# EasyEDA Pro project ax08_doc.eprj, schematic ax08 main, sheets 14 to 16 of 16

## Sheets
14 carry unit: Page Name: carry unit
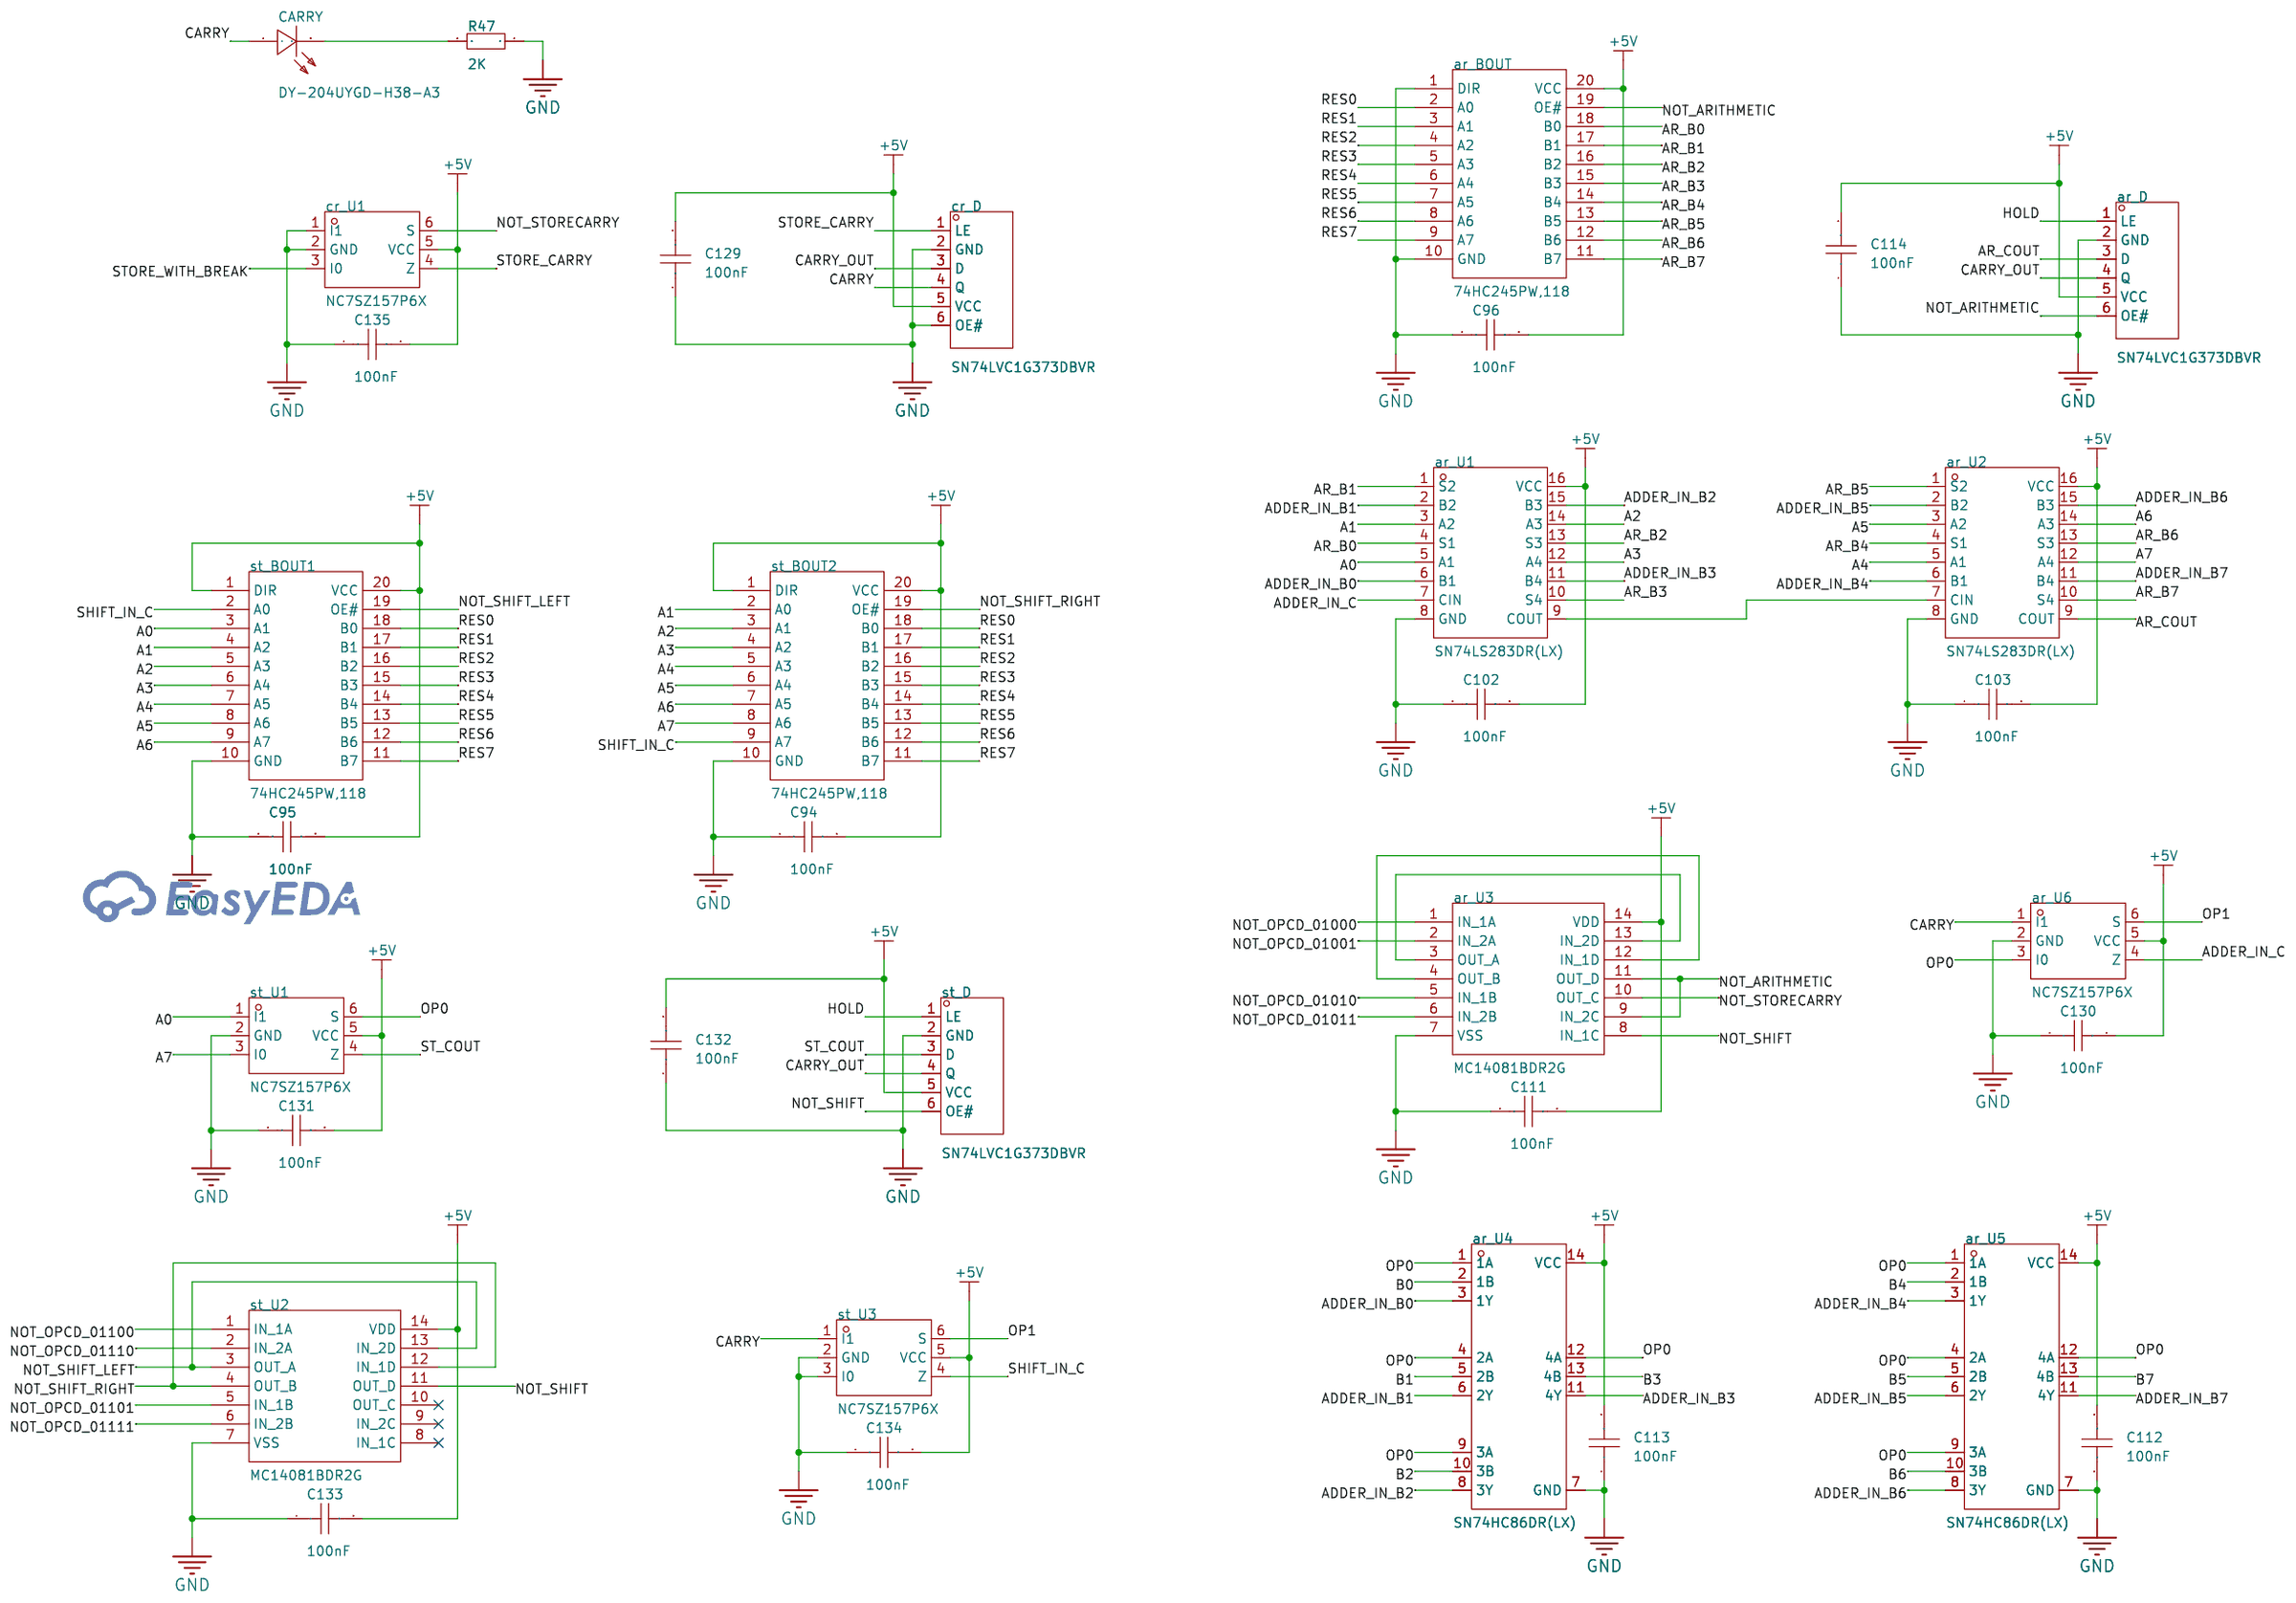
[diagram p18: carry unit]
15 power: Page Name: power; Update Date: 2025-09-11
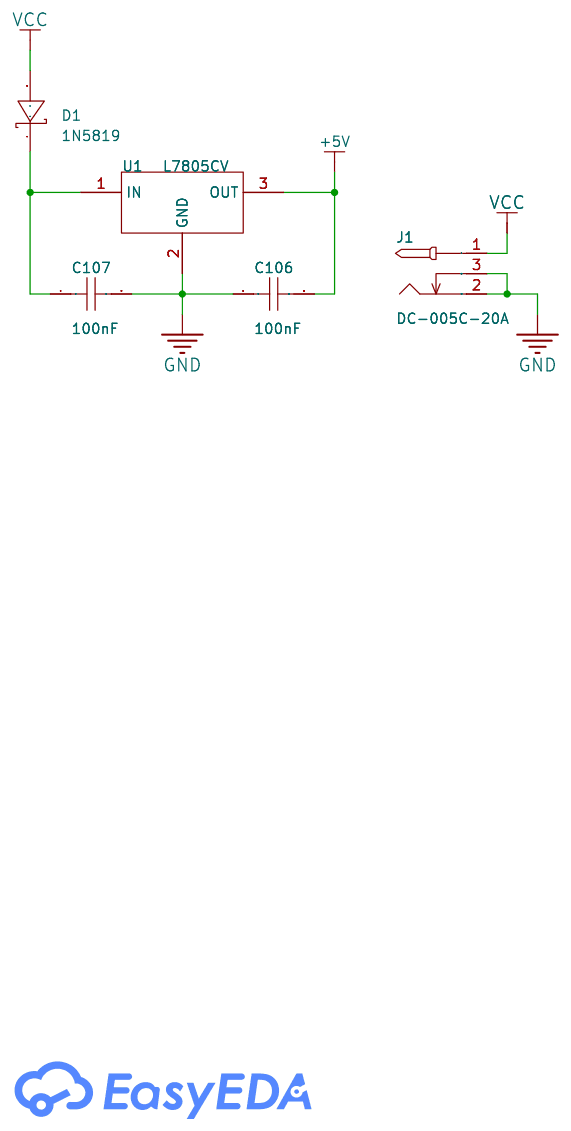
[diagram p19: power]
16 debug utils: Page Name: debug utils
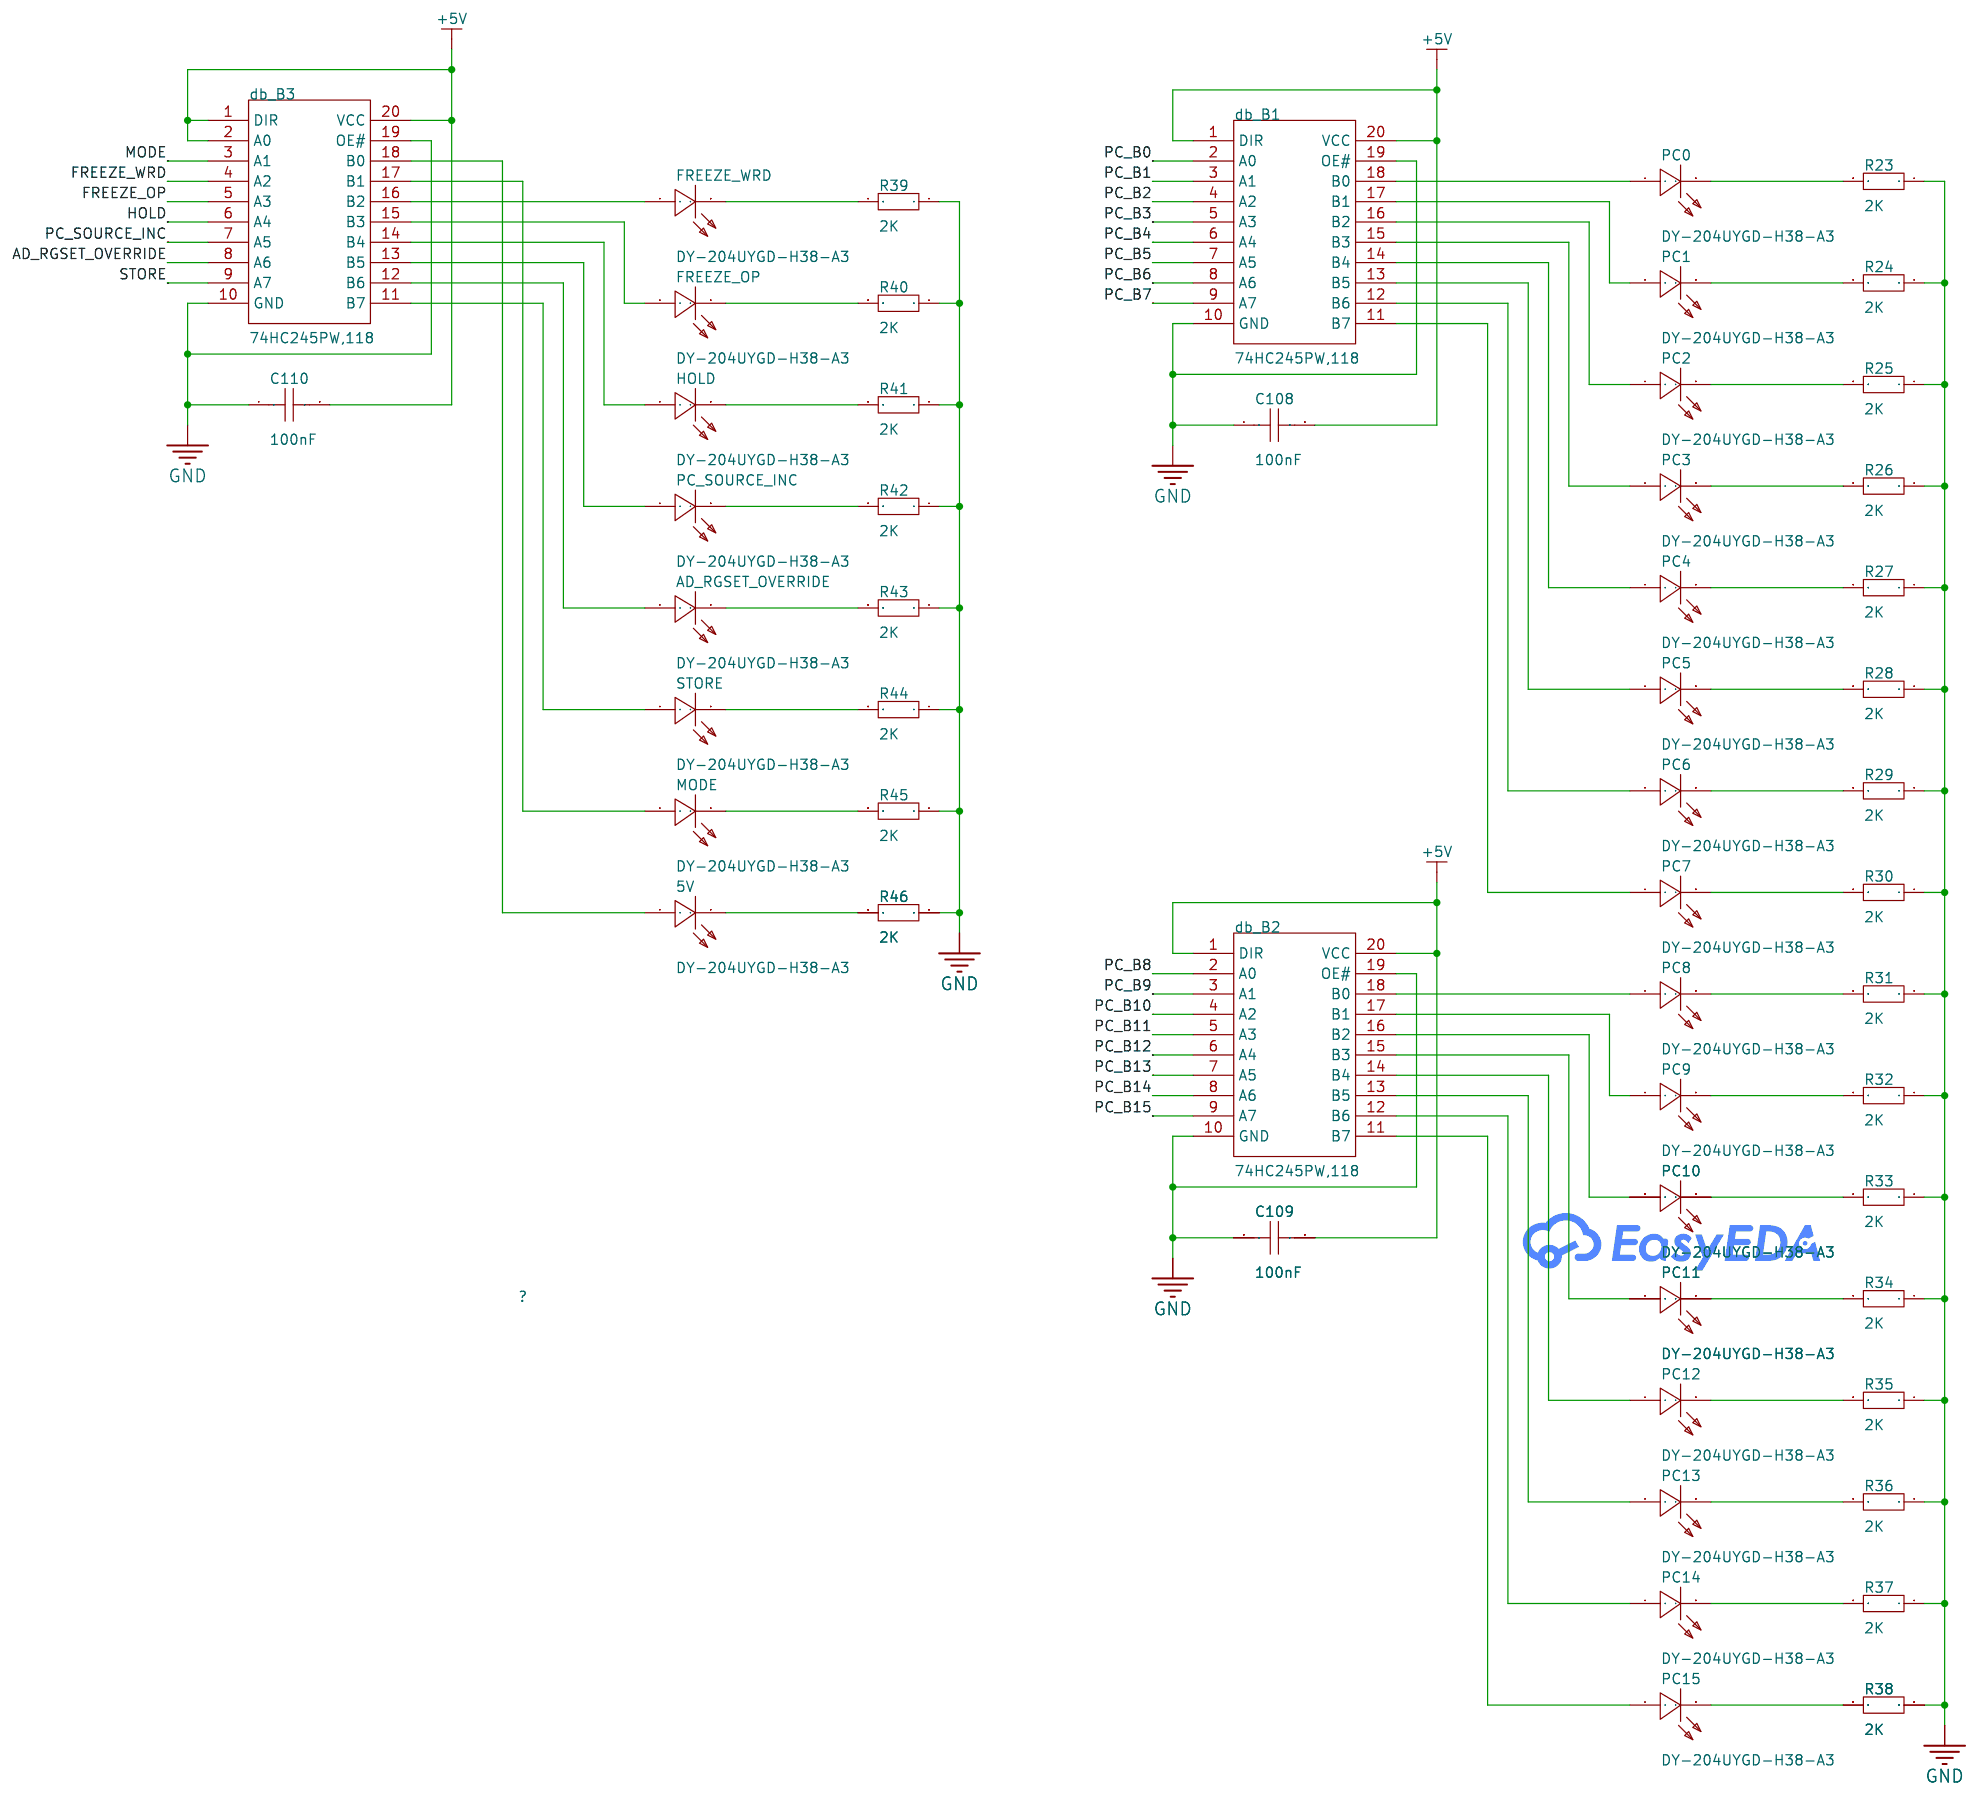
[diagram p20: debug utils]

## Parts
sheet carry unit
ar_BOUT  74HC245PW,118  [TSSOP-20_L6.5-W4.4-P0.65-LS6.4-BL]
ar_D  SN74LVC1G373DBVR  [SOT-23-6_L2.9-W1.6-P0.95-LS2.8-BR]
ar_U1  SN74LS283DR(LX)  [SOIC-16_L9.9-W3.9-P1.27-LS6.0-BL-1]
ar_U2  SN74LS283DR(LX)  [SOIC-16_L9.9-W3.9-P1.27-LS6.0-BL-1]
ar_U3  MC14081BDR2G  [SOIC-14_L8.7-W3.9-P1.27-LS6.0-BL]
ar_U4  SN74HC86DR(LX)  [SOP-14_L8.5-W3.8-P1.27-LS6.2-BL]
ar_U5  SN74HC86DR(LX)  [SOP-14_L8.5-W3.8-P1.27-LS6.2-BL]
ar_U6  NC7SZ157P6X  [SC-70-6_L2.0-W1.3-P0.65-LS2.1-BR]
C94  100nF  [C0805]
C95  100nF  [C0805]
C96  100nF  [C0805]
C102  100nF  [C0805]
C103  100nF  [C0805]
C111  100nF  [C0805]
C112  100nF  [C0805]
C113  100nF  [C0805]
C114  100nF  [C0805]
C129  100nF  [C0805]
C130  100nF  [C0805]
C131  100nF  [C0805]
C132  100nF  [C0805]
C133  100nF  [C0805]
C134  100nF  [C0805]
C135  100nF  [C0805]
CARRY  DY-204UYGD-H38-A3  [LED-TH_BD4.0-P2.54-FD]
cr_D  SN74LVC1G373DBVR  [SOT-23-6_L2.9-W1.6-P0.95-LS2.8-BR]
cr_U1  NC7SZ157P6X  [SC-70-6_L2.0-W1.3-P0.65-LS2.1-BR]
R47  2K  [R0805_1]
st_BOUT1  74HC245PW,118  [TSSOP-20_L6.5-W4.4-P0.65-LS6.4-BL]
st_BOUT2  74HC245PW,118  [TSSOP-20_L6.5-W4.4-P0.65-LS6.4-BL]
st_D  SN74LVC1G373DBVR  [SOT-23-6_L2.9-W1.6-P0.95-LS2.8-BR]
st_U1  NC7SZ157P6X  [SC-70-6_L2.0-W1.3-P0.65-LS2.1-BR]
st_U2  MC14081BDR2G  [SOIC-14_L8.7-W3.9-P1.27-LS6.0-BL]
st_U3  NC7SZ157P6X  [SC-70-6_L2.0-W1.3-P0.65-LS2.1-BR]
sheet debug utils
5V  DY-204UYGD-H38-A3  [LED-TH_BD4.0-P2.54-FD]
AD_RGSET_OVERRIDE  DY-204UYGD-H38-A3  [LED-TH_BD4.0-P2.54-FD]
C108  100nF  [C0805]
C109  100nF  [C0805]
C110  100nF  [C0805]
db_B1  74HC245PW,118  [TSSOP-20_L6.5-W4.4-P0.65-LS6.4-BL]
db_B2  74HC245PW,118  [TSSOP-20_L6.5-W4.4-P0.65-LS6.4-BL]
db_B3  74HC245PW,118  [TSSOP-20_L6.5-W4.4-P0.65-LS6.4-BL]
FREEZE_OP  DY-204UYGD-H38-A3  [LED-TH_BD4.0-P2.54-FD]
FREEZE_WRD  DY-204UYGD-H38-A3  [LED-TH_BD4.0-P2.54-FD]
HOLD  DY-204UYGD-H38-A3  [LED-TH_BD4.0-P2.54-FD]
MODE  DY-204UYGD-H38-A3  [LED-TH_BD4.0-P2.54-FD]
PC0  DY-204UYGD-H38-A3  [LED-TH_BD4.0-P2.54-FD]
PC1  DY-204UYGD-H38-A3  [LED-TH_BD4.0-P2.54-FD]
PC2  DY-204UYGD-H38-A3  [LED-TH_BD4.0-P2.54-FD]
PC3  DY-204UYGD-H38-A3  [LED-TH_BD4.0-P2.54-FD]
PC4  DY-204UYGD-H38-A3  [LED-TH_BD4.0-P2.54-FD]
PC5  DY-204UYGD-H38-A3  [LED-TH_BD4.0-P2.54-FD]
PC6  DY-204UYGD-H38-A3  [LED-TH_BD4.0-P2.54-FD]
PC7  DY-204UYGD-H38-A3  [LED-TH_BD4.0-P2.54-FD]
PC8  DY-204UYGD-H38-A3  [LED-TH_BD4.0-P2.54-FD]
PC9  DY-204UYGD-H38-A3  [LED-TH_BD4.0-P2.54-FD]
PC10  DY-204UYGD-H38-A3  [LED-TH_BD4.0-P2.54-FD]
PC11  DY-204UYGD-H38-A3  [LED-TH_BD4.0-P2.54-FD]
PC12  DY-204UYGD-H38-A3  [LED-TH_BD4.0-P2.54-FD]
PC13  DY-204UYGD-H38-A3  [LED-TH_BD4.0-P2.54-FD]
PC14  DY-204UYGD-H38-A3  [LED-TH_BD4.0-P2.54-FD]
PC15  DY-204UYGD-H38-A3  [LED-TH_BD4.0-P2.54-FD]
PC_SOURCE_INC  DY-204UYGD-H38-A3  [LED-TH_BD4.0-P2.54-FD]
R23  2K  [R0805_1]
R24  2K  [R0805_1]
R25  2K  [R0805_1]
R26  2K  [R0805_1]
R27  2K  [R0805_1]
R28  2K  [R0805_1]
R29  2K  [R0805_1]
R30  2K  [R0805_1]
R31  2K  [R0805_1]
R32  2K  [R0805_1]
R33  2K  [R0805_1]
R34  2K  [R0805_1]
R35  2K  [R0805_1]
R36  2K  [R0805_1]
R37  2K  [R0805_1]
R38  2K  [R0805_1]
R39  2K  [R0805_1]
R40  2K  [R0805_1]
R41  2K  [R0805_1]
R42  2K  [R0805_1]
R43  2K  [R0805_1]
R44  2K  [R0805_1]
R45  2K  [R0805_1]
R46  2K  [R0805_1]
STORE  DY-204UYGD-H38-A3  [LED-TH_BD4.0-P2.54-FD]
sheet power
C106  100nF  [C0805]
C107  100nF  [C0805]
D1  1N5819  [DO-41_BD2.4-L4.7-P8.70-D0.9-RD]
J1  DC-005C-20A  [DC-IN-TH_DC-005C-20A]
U1  L7805CV  [TO-220-3_L10.0-W4.5-P2.54-L]

## Library data of the parts
ar_BOUT db_B1-db_B3 st_BOUT1 st_BOUT2 = 74HC245PW,118: Input type:- output type:Tri-State Supply Voltage:2V~6V Supply Voltage:2V~6V Number of Elements:1 Number of Bits per Element:8 Channel Type:- Sink Current:7.8mA Source Current:7.8mA Logic Family:74HC Operating Temperature:-40℃~+125℃ Operating Temperature:; Supplier Part: C5626; Manufacturer: Nexperia(安世); Supplier Footprint: TSSOP-20; JLCPCB Part Class: Extended Part; Datasheet: https://atta.szlcsc.com/upload/public/pdf/source/20240724/EDC8C45902BA97AEC59E8811E3964917.pdf; Supplier: LCSC; output type: Tri-State; Supply Voltage: 2V~6V; Number of Elements: 1; Number of Bits per Element: 8; Sink Current: 7.8mA; Source Current: 7.8mA; Logic Family: 74HC; Operating Temperature: -40℃~+125℃
ar_D cr_D st_D = SN74LVC1G373DBVR: LCSC Part Name: 三态输出D型锁存器; Supplier Part: C128413; Manufacturer: TI(德州仪器); Supplier Footprint: SOT-23-6; JLCPCB Part Class: Extended Part; Datasheet: https://www.ti.com/cn/lit/gpn/sn74lvc1g373; Supplier: LCSC; Logic Type: D-Type Locking Device; Output Type: Tri-State; Supply Voltage: 1.65V~5.5V; Source Current: 32mA; Sink Current: 32mA; Propagation Delay: 1ns; OperatingTemperature: -40℃~+125℃
ar_U1 ar_U2 = SN74LS283DR(LX): Supplier Part: C22374103; Manufacturer: LX(灵星芯微); Supplier Footprint: SOP-16; JLCPCB Part Class: Extended Part; Datasheet: https://atta.szlcsc.com/upload/public/pdf/source/20240402/80BBEEF0EDCF1C8215BAA06339FE4235.pdf; Supplier: LCSC; Logic Type: Binary Full Adder; Number of Channels: 4; Supply Voltage: 2V~6V; Operating Temperature: -40℃~+125℃
ar_U3 st_U2 = MC14081BDR2G: Supplier Part: C52342; Manufacturer: onsemi(安森美); Supplier Footprint: SOIC-14; JLCPCB Part Class: Extended Part; Datasheet: https://atta.szlcsc.com/upload/public/pdf/source/20191203/C463300_6D19168778DBD465A86B239F140F6B23.pdf; Supplier: LCSC; Logic Gate Type: With Door; Number of Channels: 4; Supply Voltage: 3V~18V; Quiescent Current (Max): 1uA; Sink Current: 8.8mA; Source Current: 8.8mA; High Level Range (VIH): 3.5V~11V; Low Level Range (VIL): 1.5V~4V; Series: 4000BSeries; Propagation Delay Time: 100ns@15V,50pF; Operating Temperature: -55℃~+125℃
ar_U4 ar_U5 = SN74HC86DR(LX): LCSC Part Name: 集成电路; Supplier Part: C22436997; Manufacturer: LX(灵星芯微); Supplier Footprint: SOP-14; JLCPCB Part Class: Extended Part; Datasheet: https://atta.szlcsc.com/upload/public/pdf/source/20240524/675B1C928075FFB7AC00BEC82378813F.pdf; Supplier: LCSC; Logic Gate Type: XORGate; Number of Channels: 4; Supply Voltage: 2V~6V; Quiescent Current (Max): 2uA; High Level Range (VIH): 1.5V~4.2V; Low Level Range (VIL): 500mV~1.8V; Series: 74HCSeries; Propagation Delay Time: 20ns@6V,50pF; Operating Temperature: -40℃~+125℃
ar_U6 cr_U1 st_U1 st_U3 = NC7SZ157P6X: Supplier Part: C77686; Manufacturer: onsemi(安森美); Supplier Footprint: SC-70-6; JLCPCB Part Class: Extended Part; Datasheet: https://item.szlcsc.com/datasheet/NC7SZ157P6X/78815.html; Supplier: LCSC; Type: Multiplexer; Voltage Supply Source: Single Supply; Voltage - Supply: 1.65V~5.5V; Current - Output Low(IOL): 32mA; Current - Output High(IOH): 32mA; Operating temperature: -40℃~+85℃
C94-C96 C102 C103 C106-C114 C129-C135 = CC0805KRX7R9BB104: Capacitance: Tolerance:±10% Tolerance:±10% Voltage Rated: Temperature Coefficient:; LCSC Part Name: 100nF ±10% 50V; Supplier Part: C49678; Manufacturer: YAGEO(国巨); Supplier Footprint: 0805; JLCPCB Part Class: Basic Part; Datasheet: https://atta.szlcsc.com/upload/public/pdf/source/20180224/C181747_15194369449651363981.pdf; Supplier: LCSC; Tolerance: ±10%
5V AD_RGSET_OVERRIDE CARRY FREEZE_OP FREEZE_WRD HOLD MODE PC0-PC15 PC_SOURCE_INC STORE = DY-204UYGD-H38-A3: LCSC Part Name: 3mm圆头有边黄绿色; Supplier Part: C7470727; Manufacturer: TONYU(东裕); Supplier Footprint: D=3mm; JLCPCB Part Class: Extended Part; Datasheet: https://atta.szlcsc.com/upload/public/pdf/source/20230726/000EB079CD0A8C169FA94F7B667CD1E2.pdf; Supplier: LCSC
R23-R47 = Res_0603: Supplier Footprint: 0603
D1 = 1N5819_C237257: LCSC Part Name: 电压:40V 电流:1A; Supplier Part: C237257; Manufacturer: HL(豪林); Supplier Footprint: DO-41; JLCPCB Part Class: Extended Part; Supplier: LCSC; Forward Voltage (Vf@If): 600mV@1A; Reverse Voltage (Vr): 40V; Average Rectified Current (Io): 1A
J1 = DC-005C-20A: LCSC Part Name: DC电源插座 内径:2mm 外径:6.4mm; Supplier Part: C84007; Manufacturer: 韩国韩荣; Supplier Footprint: 插件; JLCPCB Part Class: Extended Part; Datasheet: https://atta.szlcsc.com/upload/public/pdf/source/20210810/A9F07BBB960FE584CB8DE17AFB8953D7.pdf; Supplier: LCSC; Connector Type: DC Power Receptacle; Mounting Style: Bend insert; Inside Contact Diameter: 2mm; Outside Contact Diameter: 6.4mm; Current Rating (Max): 3A; Voltage Rating (Max): 24V; Operating Temperature Range: -20℃~+70℃
U1 = L7805CV_C111887: LCSC Part Name: 正稳压器IC; Supplier Part: C111887; Manufacturer: ST(意法半导体); Supplier Footprint: TO-220; JLCPCB Part Class: Extended Part; Datasheet: https://atta.szlcsc.com/upload/public/pdf/source/20180606/C192854_20B6D8F8F52B6FFCE5644906251095FD.pdf; Supplier: LCSC; Output Type: Fixed; Maximum Input Voltage: 35V; Output Voltage: 5V; Output Current: 1.5A; Power Supply Rejection Ratio (PSRR): 62dB@(120Hz); Dropout Voltage: 2V@(1A); standby current: 8mA; Feature: Short-Circuit  Protection；Thermal Protection(TSD)；Overcurrent Protection(OCP); Operating Temperature: 0℃~+125℃; Output Polarity: Positive electrode; Number of Outputs: 1

## Nets
+5V: ar_BOUT.20(VCC) ar_D.5(VCC) ar_U1.16(VCC) ar_U2.16(VCC) ar_U3.14(VDD) ar_U4.14(VCC) ar_U5.14(VCC) ar_U6.5(VCC) C94.2 C95.2 C96.2 C102.2 C103.2 C106.2 C108.2 C109.2 C110.2 C111.2 C112.2 C113.2 C114.2 C129.2 C130.2 C131.2 C132.2 C133.2 C134.2 C135.2 cr_D.5(VCC) cr_U1.5(VCC) db_B1.1(DIR) db_B1.20(VCC) db_B2.1(DIR) db_B2.20(VCC) db_B3.1(DIR) db_B3.2(A0) db_B3.20(VCC) st_BOUT1.1(DIR) st_BOUT1.20(VCC) st_BOUT2.1(DIR) st_BOUT2.20(VCC) st_D.5(VCC) st_U1.5(VCC) st_U2.14(VDD) st_U3.5(VCC) U1.3(OUT) ; also on sheet 1 2 3 4 5 6 7 8 9 10 11 12 13
GND: ar_BOUT.1(DIR) ar_BOUT.10(GND) ar_D.2(GND) ar_U1.8(GND) ar_U2.8(GND) ar_U3.7(VSS) ar_U4.7(GND) ar_U5.7(GND) ar_U6.2(GND) C94.1 C95.1 C96.1 C102.1 C103.1 C106.1 C107.2 C108.1 C109.1 C110.1 C111.1 C112.1 C113.1 C114.1 C129.1 C130.1 C131.1 C132.1 C133.1 C134.1 C135.1 cr_D.2(GND) cr_D.6(OE#) cr_U1.1(I1) cr_U1.2(GND) db_B1.10(GND) db_B1.19(OE#) db_B2.10(GND) db_B2.19(OE#) db_B3.10(GND) db_B3.19(OE#) J1.2 J1.3 R23.1 R24.1 R25.1 R26.1 R27.1 R28.1 R29.1 R30.1 R31.1 R32.1 R33.1 R34.1 R35.1 R36.1 R37.1 R38.1 R39.1 R40.1 R41.1 R42.1 R43.1 R44.1 R45.1 R46.1 R47.1 st_BOUT1.10(GND) st_BOUT2.10(GND) st_D.2(GND) st_U1.2(GND) st_U2.7(VSS) st_U3.2(GND) st_U3.3(I0) U1.2(GND) ; also on sheet 1 2 3 4 5 6 7 8 9 10 11 12 13
VCC: D1.2(A) J1.1 ; also on sheet 5
A0: ar_U1.5(A1) st_BOUT1.3(A1) st_U1.1(I1) ; also on sheet 1 2 4 5 10 11 12 13
A1: ar_U1.3(A2) st_BOUT1.4(A2) st_BOUT2.2(A0) ; also on sheet 1 2 4 5 10 11 12 13
A2: ar_U1.14(A3) st_BOUT1.5(A3) st_BOUT2.3(A1) ; also on sheet 1 2 4 5 10 11 12 13
A3: ar_U1.12(A4) st_BOUT1.6(A4) st_BOUT2.4(A2) ; also on sheet 1 2 4 5 10 11 13
A4: ar_U2.5(A1) st_BOUT1.7(A5) st_BOUT2.5(A3) ; also on sheet 1 2 4 5 10 11 13
A5: ar_U2.3(A2) st_BOUT1.8(A6) st_BOUT2.6(A4) ; also on sheet 1 2 4 5 10 11 13
A6: ar_U2.14(A3) st_BOUT1.9(A7) st_BOUT2.7(A5) ; also on sheet 1 2 4 5 10 11 13
A7: ar_U2.12(A4) st_BOUT2.8(A6) st_U1.3(I0) ; also on sheet 1 2 4 5 10 11 13
AD_RGSET_OVERRIDE: db_B3.8(A6) ; also on sheet 3 8
ADDER_IN_B0: ar_U1.6(B1) ar_U4.3(1Y)
ADDER_IN_B1: ar_U1.2(B2) ar_U4.6(2Y)
ADDER_IN_B2: ar_U1.15(B3) ar_U4.8(3Y)
ADDER_IN_B3: ar_U1.11(B4) ar_U4.11(4Y)
ADDER_IN_B4: ar_U2.6(B1) ar_U5.3(1Y)
ADDER_IN_B5: ar_U2.2(B2) ar_U5.6(2Y)
ADDER_IN_B6: ar_U2.15(B3) ar_U5.8(3Y)
ADDER_IN_B7: ar_U2.11(B4) ar_U5.11(4Y)
ADDER_IN_C: ar_U1.7(CIN) ar_U6.4(Z)
AR_B0: ar_BOUT.18(B0) ar_U1.4(S1)
AR_B1: ar_BOUT.17(B1) ar_U1.1(S2)
AR_B2: ar_BOUT.16(B2) ar_U1.13(S3)
AR_B3: ar_BOUT.15(B3) ar_U1.10(S4)
AR_B4: ar_BOUT.14(B4) ar_U2.4(S1)
AR_B5: ar_BOUT.13(B5) ar_U2.1(S2)
AR_B6: ar_BOUT.12(B6) ar_U2.13(S3)
AR_B7: ar_BOUT.11(B7) ar_U2.10(S4)
AR_COUT: ar_D.3(D) ar_U2.9(COUT)
B0: ar_U4.2(1B) ; also on sheet 1 2 4 5 11 13
B1: ar_U4.5(2B) ; also on sheet 1 2 4 5 11 13
B2: ar_U4.10(3B) ; also on sheet 1 2 4 5 11 13
B3: ar_U4.13(4B) ; also on sheet 1 2 4 5 11 13
B4: ar_U5.2(1B) ; also on sheet 1 2 4 5 11 13
B5: ar_U5.5(2B) ; also on sheet 1 2 4 5 11 13
B6: ar_U5.10(3B) ; also on sheet 1 2 4 5 11 13
B7: ar_U5.13(4B) ; also on sheet 1 2 4 5 11 13
CARRY: ar_U6.1(I1) CARRY.1(A) cr_D.4(Q) st_U3.1(I1)
CARRY_OUT: ar_D.4(Q) cr_D.3(D) st_D.4(Q)
FREEZE_OP: db_B3.5(A3) ; also on sheet 5 8
FREEZE_WRD: db_B3.4(A2) ; also on sheet 2 5 8
HOLD: ar_D.1(LE) db_B3.6(A4) st_D.1(LE) ; also on sheet 5 6 8 10
MODE: db_B3.3(A1) ; also on sheet 2 7 8
NOT_ARITHMETIC: ar_BOUT.19(OE#) ar_D.6(OE#) ar_U3.9(IN 2C) ar_U3.11(OUT D)
NOT_OPCD_01000: ar_U3.1(IN 1A) ; also on sheet 9
NOT_OPCD_01001: ar_U3.2(IN 2A) ; also on sheet 9
NOT_OPCD_01010: ar_U3.5(IN 1B) ; also on sheet 9
NOT_OPCD_01011: ar_U3.6(IN 2B) ; also on sheet 9
NOT_OPCD_01100: st_U2.1(IN 1A) ; also on sheet 9
NOT_OPCD_01101: st_U2.5(IN 1B) ; also on sheet 9
NOT_OPCD_01110: st_U2.2(IN 2A) ; also on sheet 9
NOT_OPCD_01111: st_U2.6(IN 2B) ; also on sheet 9
NOT_SHIFT: ar_U3.8(IN 1C) st_D.6(OE#) st_U2.11(OUT D)
NOT_SHIFT_LEFT: st_BOUT1.19(OE#) st_U2.3(OUT A) st_U2.13(IN 2D)
NOT_SHIFT_RIGHT: st_BOUT2.19(OE#) st_U2.4(OUT B) st_U2.12(IN 1D)
NOT_STORECARRY: ar_U3.10(OUT C) cr_U1.6(S)
OP0: ar_U4.1(1A) ar_U4.4(2A) ar_U4.9(3A) ar_U4.12(4A) ar_U5.1(1A) ar_U5.4(2A) ar_U5.9(3A) ar_U5.12(4A) ar_U6.3(I0) st_U1.6(S) ; also on sheet 5 9
OP1: ar_U6.6(S) st_U3.6(S) ; also on sheet 5 9
PC_B0: db_B1.2(A0) ; also on sheet 2 5
PC_B1: db_B1.3(A1) ; also on sheet 2 5
PC_B2: db_B1.4(A2) ; also on sheet 2 5
PC_B3: db_B1.5(A3) ; also on sheet 2 5
PC_B4: db_B1.6(A4) ; also on sheet 2 5
PC_B5: db_B1.7(A5) ; also on sheet 2 5
PC_B6: db_B1.8(A6) ; also on sheet 2 5
PC_B7: db_B1.9(A7) ; also on sheet 2 5
PC_B8: db_B2.2(A0) ; also on sheet 2 5
PC_B9: db_B2.3(A1) ; also on sheet 2 5
PC_B10: db_B2.4(A2) ; also on sheet 2 5
PC_B11: db_B2.5(A3) ; also on sheet 2 5
PC_B12: db_B2.6(A4) ; also on sheet 2 5
PC_B13: db_B2.7(A5) ; also on sheet 2 5
PC_B14: db_B2.8(A6) ; also on sheet 2 5
PC_B15: db_B2.9(A7) ; also on sheet 2 5
PC_SOURCE_INC: db_B3.7(A5) ; also on sheet 2 8
RES0: ar_BOUT.2(A0) st_BOUT1.18(B0) st_BOUT2.18(B0) ; also on sheet 5 6 10 11 12 13
RES1: ar_BOUT.3(A1) st_BOUT1.17(B1) st_BOUT2.17(B1) ; also on sheet 5 6 10 11 12 13
RES2: ar_BOUT.4(A2) st_BOUT1.16(B2) st_BOUT2.16(B2) ; also on sheet 5 6 10 11 12 13
RES3: ar_BOUT.5(A3) st_BOUT1.15(B3) st_BOUT2.15(B3) ; also on sheet 5 6 10 11 12 13
RES4: ar_BOUT.6(A4) st_BOUT1.14(B4) st_BOUT2.14(B4) ; also on sheet 5 6 10 11 12 13
RES5: ar_BOUT.7(A5) st_BOUT1.13(B5) st_BOUT2.13(B5) ; also on sheet 5 6 10 11 12 13
RES6: ar_BOUT.8(A6) st_BOUT1.12(B6) st_BOUT2.12(B6) ; also on sheet 5 6 10 11 12 13
RES7: ar_BOUT.9(A7) st_BOUT1.11(B7) st_BOUT2.11(B7) ; also on sheet 5 6 10 11 12 13
SHIFT_IN_C: st_BOUT1.2(A0) st_BOUT2.9(A7) st_U3.4(Z)
ST_COUT: st_D.3(D) st_U1.4(Z)
STORE: db_B3.9(A7) ; also on sheet 8 9
STORE_CARRY: cr_D.1(LE) cr_U1.4(Z)
STORE_WITH_BREAK: cr_U1.3(I0) ; also on sheet 3
$17N4980: ar_U1.9(COUT) ar_U2.7(CIN)
$17N5083: CARRY.2(K) R47.2
$17N10497: ar_U3.3(OUT A) ar_U3.13(IN 2D)
$17N10505: ar_U3.4(OUT B) ar_U3.12(IN 1D)
$19N471: C107.1 D1.1(K) U1.1(IN)
$20N946: PC0.2(K) R23.2
$20N972: PC1.2(K) R24.2
$20N998: PC2.2(K) R25.2
$20N1024: PC3.2(K) R26.2
$20N1050: PC4.2(K) R27.2
$20N1076: PC5.2(K) R28.2
$20N1102: PC6.2(K) R29.2
$20N1128: PC7.2(K) R30.2
$20N1154: PC8.2(K) R31.2
$20N1180: PC9.2(K) R32.2
$20N1206: PC10.2(K) R33.2
$20N1232: PC11.2(K) R34.2
$20N1258: PC12.2(K) R35.2
$20N1284: PC13.2(K) R36.2
$20N1310: PC14.2(K) R37.2
$20N1336: PC15.2(K) R38.2
$20N2149: db_B1.18(B0) PC0.1(A)
$20N2153: db_B1.17(B1) PC1.1(A)
$20N2159: db_B1.16(B2) PC2.1(A)
$20N2165: db_B1.15(B3) PC3.1(A)
$20N2171: db_B1.14(B4) PC4.1(A)
$20N2177: db_B1.13(B5) PC5.1(A)
$20N2183: db_B1.12(B6) PC6.1(A)
$20N2191: db_B1.11(B7) PC7.1(A)
$20N2195: db_B2.15(B3) PC11.1(A)
$20N2199: db_B2.17(B1) PC9.1(A)
$20N2203: db_B2.16(B2) PC10.1(A)
$20N2207: db_B2.13(B5) PC13.1(A)
$20N2211: db_B2.14(B4) PC12.1(A)
$20N2215: db_B2.12(B6) PC14.1(A)
$20N2219: db_B2.11(B7) PC15.1(A)
$20N2223: db_B2.18(B0) PC8.1(A)
$20N3734: PC_SOURCE_INC.2(K) R42.2
$20N3735: AD_RGSET_OVERRIDE.2(K) R43.2
$20N3736: R44.2 STORE.2(K)
$20N3737: MODE.2(K) R45.2
$20N3738: FREEZE_OP.2(K) R40.2
$20N3739: FREEZE_WRD.2(K) R39.2
$20N3740: HOLD.2(K) R41.2
$20N3742: 5V.2(K) R46.2
$20N3743: 5V.1(A) db_B3.18(B0)
$20N3744: db_B3.11(B7) STORE.1(A)
$20N3745: AD_RGSET_OVERRIDE.1(A) db_B3.12(B6)
$20N3746: db_B3.13(B5) PC_SOURCE_INC.1(A)
$20N3747: db_B3.17(B1) MODE.1(A)
$20N3748: db_B3.14(B4) HOLD.1(A)
$20N3749: db_B3.15(B3) FREEZE_OP.1(A)
$20N3922: db_B3.16(B2) FREEZE_WRD.1(A)

Not connected (* = marked no-connect by the designer): st_U2 8(IN 1C)* 9(IN 2C)* 10(OUT C)*
